# Altium schematic sheet Power.SchDoc
size A; SheetNumber: 2; SheetTotal: 7
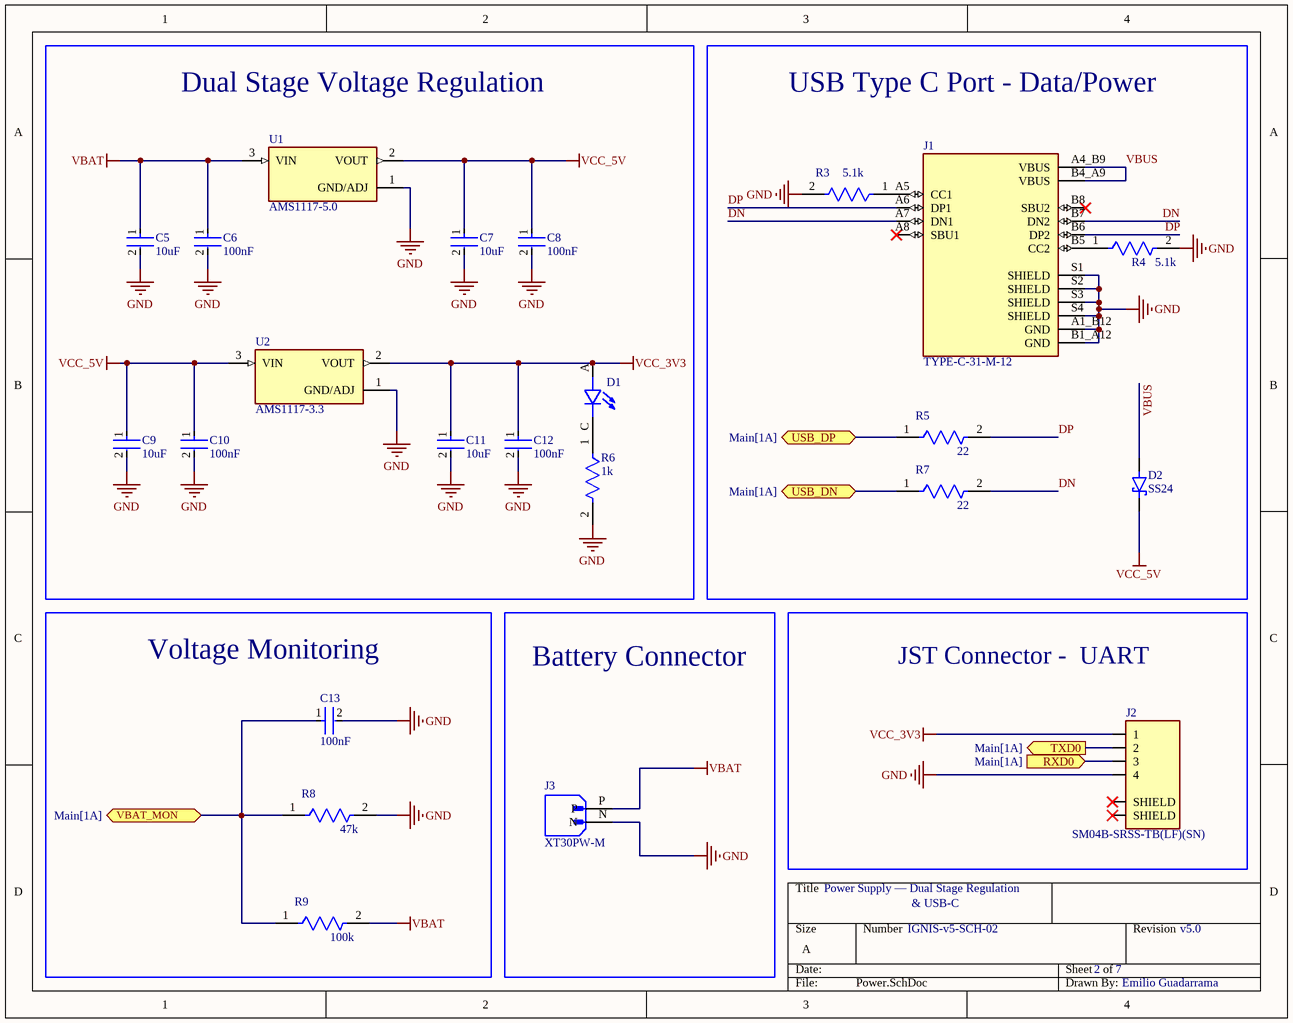
[diagram p0: Power.SchDoc]

## Parts
C5  10uF  [FP-C0805C-DN-MFG]
C6  100nF  [FP-C0805C-DN-MFG]
C7  10uF  [FP-C0805C-DN-MFG]
C8  100nF  [FP-C0805C-DN-MFG]
C9  10uF  [FP-C0805C-DN-MFG]
C10  100nF  [FP-C0805C-DN-MFG]
C11  10uF  [FP-C0805C-DN-MFG]
C12  100nF  [FP-C0805C-DN-MFG]
C13  100nF  [FP-C0805C-DN-MFG]
D1  SML-LXT0805IW-TR  [LEDC2012X120N]  (value not drawn)
D2  SS24  [DIOM4336X265N]
J1  TYPE-C-31-M-12  [HRO_TYPE-C-31-M-12]
J2  SM04B-SRSS-TB(LF)(SN)  [JST_SM04B-SRSS-TB(LF)(SN)]
J3  XT30PW-M  [AMASS_XT30PW-M]
R3  5.1k  [FP-MCT0603-IPC_A]
R4  5.1k  [FP-MCT0603-IPC_A]
R5  22  [FP-MCT0603-IPC_A]
R6  1k  [FP-MCT0603-IPC_A]
R7  22  [FP-MCT0603-IPC_A]
R8  47k  [FP-MCT0603-IPC_A]
R9  100k  [FP-MCT0603-IPC_A]
U1  AMS1117-5.0  [SOT229P700X180-4N]
U2  AMS1117-3.3  [SOT229P700X180-4N]

## Blocks framed on the sheet
Dual Stage Voltage Regulation: C5-C12 D1 R6 U1 U2
USB Type C Port - Data/Power: D2 J1 R3-R5 R7
Voltage Monitoring: C13 R8 R9
Battery Connector: J3
JST Connector -  UART: J2

## Ports
RXD0 (in, see Main[1A]), TXD0 (out, see Main[1A]), USB_DN (bidir, see Main[1A]), USB_DP (bidir, see Main[1A]), VBAT_MON (bidir, see Main[1A])

## Nets
GND: C5.2 C6.2 C7.2 C8.2 C9.2 C10.2 C11.2 C12.2 C13.2 J1.A1_B12(GND) J1.B1_A12(GND) J1.S1(SHIELD) J1.S2(SHIELD) J1.S3(SHIELD) J1.S4(SHIELD) J2.4 J3.N R3.2 R4.2 R6.2 R8.2 U1.1(GND/ADJ) U2.1(GND/ADJ)
VBAT: C5.1 C6.1 J3.P R9.2 U1.3(VIN)
VCC_3V3: C11.1 C12.1 D1.A J2.1 U2.2(VOUT)
VCC_5V: C7.1 C8.1 C9.1 C10.1 D2.C(K) U1.2(VOUT) U2.3(VIN)
DN: J1.A7(DN1) J1.B7(DN2) R7.2
DP: J1.A6(DP1) J1.B6(DP2) R5.2
RXD0: J2.3 ; port RXD0
TXD0: J2.2 ; port TXD0
USB_DN: R7.1 ; port USB_DN
USB_DP: R5.1 ; port USB_DP
VBAT_MON: C13.1 R8.1 R9.1 ; port VBAT_MON
VBUS: D2.A J1.A4_B9(VBUS) J1.B4_A9(VBUS)
NetD1_C: D1.C R6.1
NetJ1_A5: J1.A5(CC1) R3.1
NetJ1_B5: J1.B5(CC2) R4.1

Not connected (* = marked no-connect by the designer): J1 A8(SBU1)* B8(SBU2)*; J2 S1(SHIELD)* S2(SHIELD)*

## Notes on the sheet
- Power Supply — Dual Stage Regulation
- & USB-C
- IGNIS-v5-SCH-02
- 2
- 7
- v5.0
- Emilio Guadarrama

## Library data of the parts
C5-C13 = CMP-2007-00279-2: CAP CER 0.1UF 50V X7R 0805; Manufacturer Part Number: C0805C104K5RACTU; Manufacturer: KEMET; Tolerance: 0.1; Temperature Coefficient: 30ppm/°C; Material: Ceramic; Device Class L2: Capacitors; Temperature Range Low: -55°C; Voltage Rating: 50 V; Digikey Description: CAP CER 0.1UF 50V X7R 0805; Category: Cap; ComponentLink2Description: Datasheet; Octopart: https://octopart.com/c0805c104k5ractu-kemet-143926; RoHS: TRUE; ComponentLink2URL: https://content.kemet.com/datasheets/KEM_C1003_C0G_SMD.pdf; Temperature Characteristic: X7R; Temperature: -55°C to +125°C; Height: 0.88mm; Temperature Range High: +125°C; Device Class L1: Passive Components; Automotive: No; Lead Free: Yes; Ipc Land Pattern Name: CAPC200125X78; Device Class L3: Ceramic Capacitors; Mouser Description: Cap Ceramic 0.1uF 50V X7R 10% SMD 2.0 x 1.2 mm 125 C Paper T/R; Package: C0805C-DN
  C5 C7 C9 C11: Value: 10 uF; Capacitance: 10 uF
  C6 C8 C10 C12 C13: Value: 100 nF; Capacitance: 100 nF
D1 = SML-LXT0805IW-TR: LED;Red;11mcd;0.061In.Dia.;SMD;100mA;2V Vf;635nm;140deg;SMD;White Diffused;5V Vr | Lumex SML-LXT0805IW-TR; MF: Lumex Opto/Components; SnapEDA_Link: https://www.snapeda.com/parts/SML-LXT0805IW-TR/Lumex+Opto%252FComponents+Inc./view-part/?ref=snap; Package: 0805 Lumex; Value: *; MP: SML-LXT0805IW-TR; Check_prices: https://www.snapeda.com/parts/SML-LXT0805IW-TR/Lumex+Opto%252FComponents+Inc./view-part/?ref=eda
D2 = SS24: 2A, 40V, Schottky Rectifier; MF: Taiwan Semiconductor; Package: SMB-2 Taiwan Semiconductor; Price: None; Value: *; SnapEDA_Link: https://www.snapeda.com/parts/SS24/Taiwan+Semiconductor/view-part/?ref=snap; MP: SS24; Availability: In Stock; Check_prices: https://www.snapeda.com/parts/SS24/Taiwan+Semiconductor/view-part/?ref=eda
J1 = TYPE-C-31-M-12: USB Connectors 24 Receptacle 1 8.94*7.3mm RoHS; MF: HRO Electronics Co., Ltd.; SnapEDA_Link: https://www.snapeda.com/parts/TYPE-C-31-M-12/HRO+Electronics+Co.%252C+Ltd./view-part/?ref=snap; Package: Package; Value: *; MP: TYPE-C-31-M-12; Check_prices: https://www.snapeda.com/parts/TYPE-C-31-M-12/HRO+Electronics+Co.%252C+Ltd./view-part/?ref=eda
J2 = SM04B-SRSS-TB(LF)(SN): Connector Header Surface Mount, Right Angle 4 position 0.039 (1.00mm); MF: JST Sales; SnapEDA_Link: https://www.snapeda.com/parts/SM04B-SRSS-TB(LF)(SN)/JST/view-part/?ref=snap; Package: None; Value: *; MP: SM04B-SRSS-TB(LF)(SN); Check_prices: https://www.snapeda.com/parts/SM04B-SRSS-TB(LF)(SN)/JST/view-part/?ref=eda
J3 = XT30PW-M: Socket; DC supply; XT30; male; PIN: 2; on PCBs; THT; Colour: yellow; MF: AMASS; SnapEDA_Link: https://www.snapeda.com/parts/XT30PW-M/AMASS/view-part/?ref=snap; Package: None; Value: *; MP: XT30PW-M; Check_prices: https://www.snapeda.com/parts/XT30PW-M/AMASS/view-part/?ref=eda
R3 R4 = CMP-02407-011165-1: RES SMD 100 OHM 1% 1/8W 0603; Temperature Coefficient: 25ppm/°C; Resistance: 5.1kR; Power Rating: 125mW; Tolerance: 0.1%; Voltage Rating: 75V; Length: 1.55mm; Case Code (Imperial): 0603; Case/Package: 0603; Construction: Rectangular; Package Quantity: 1000; Number of Terminations: 2; Termination: SMD/SMT; Resistor Type: Thin Film; Features: Automotive AEC-Q200; Series: MCT 0603 - Precision; Max Operating Temperature: 155°C; Depth: 0.85mm; Max Power Dissipation: 125mW; Min Operating Temperature: -55°C; Width: 0.033inch; Case Code (Metric): 1608; Packaging: Tape and Reel; Weight: 6.7E-05oz; Military Standard: Not; Height: 0.022inch
R5 R7 = CMP-02407-011165-1: RES SMD 100 OHM 1% 1/8W 0603; Temperature Coefficient: 25ppm/°C; Resistance: 22R; Power Rating: 125mW; Tolerance: 0.1%; Voltage Rating: 75V; Length: 1.55mm; Case Code (Imperial): 0603; Case/Package: 0603; Construction: Rectangular; Package Quantity: 1000; Number of Terminations: 2; Termination: SMD/SMT; Resistor Type: Thin Film; Features: Automotive AEC-Q200; Series: MCT 0603 - Precision; Max Operating Temperature: 155°C; Depth: 0.85mm; Max Power Dissipation: 125mW; Min Operating Temperature: -55°C; Width: 0.033inch; Case Code (Metric): 1608; Packaging: Tape and Reel; Weight: 6.7E-05oz; Military Standard: Not; Height: 0.022inch
R6 = CMP-02407-011165-1: RES SMD 100 OHM 1% 1/8W 0603; Temperature Coefficient: 25ppm/°C; Resistance: 1kR; Power Rating: 125mW; Tolerance: 0.1%; Voltage Rating: 75V; Length: 1.55mm; Case Code (Imperial): 0603; Case/Package: 0603; Construction: Rectangular; Package Quantity: 1000; Number of Terminations: 2; Termination: SMD/SMT; Resistor Type: Thin Film; Features: Automotive AEC-Q200; Series: MCT 0603 - Precision; Max Operating Temperature: 155°C; Depth: 0.85mm; Max Power Dissipation: 125mW; Min Operating Temperature: -55°C; Width: 0.033inch; Case Code (Metric): 1608; Packaging: Tape and Reel; Weight: 6.7E-05oz; Military Standard: Not; Height: 0.022inch
R8 = CMP-02407-011165-1: RES SMD 100 OHM 1% 1/8W 0603; Temperature Coefficient: 25ppm/°C; Resistance: 47kR; Power Rating: 125mW; Tolerance: 0.1%; Voltage Rating: 75V; Length: 1.55mm; Case Code (Imperial): 0603; Case/Package: 0603; Construction: Rectangular; Package Quantity: 1000; Number of Terminations: 2; Termination: SMD/SMT; Resistor Type: Thin Film; Features: Automotive AEC-Q200; Series: MCT 0603 - Precision; Max Operating Temperature: 155°C; Depth: 0.85mm; Max Power Dissipation: 125mW; Min Operating Temperature: -55°C; Width: 0.033inch; Case Code (Metric): 1608; Packaging: Tape and Reel; Weight: 6.7E-05oz; Military Standard: Not; Height: 0.022inch
R9 = CMP-02407-011165-1: RES SMD 100 OHM 1% 1/8W 0603; Temperature Coefficient: 25ppm/°C; Resistance: 100kR; Power Rating: 125mW; Tolerance: 0.1%; Voltage Rating: 75V; Length: 1.55mm; Case Code (Imperial): 0603; Case/Package: 0603; Construction: Rectangular; Package Quantity: 1000; Number of Terminations: 2; Termination: SMD/SMT; Resistor Type: Thin Film; Features: Automotive AEC-Q200; Series: MCT 0603 - Precision; Max Operating Temperature: 155°C; Depth: 0.85mm; Max Power Dissipation: 125mW; Min Operating Temperature: -55°C; Width: 0.033inch; Case Code (Metric): 1608; Packaging: Tape and Reel; Weight: 6.7E-05oz; Military Standard: Not; Height: 0.022inch
U1 U2 = AMS1117-5.0: 1A LOW DROPOUT VOLTAGE REGULATOR; MF: ams; MP: AMS1117-5.0; Package: SOT-223 Seeed Technology; SnapEDA_Link: https://www.snapeda.com/parts/AMS1117-5.0/ams/view-part/?ref=snap; Check_prices: https://www.snapeda.com/parts/AMS1117-5.0/ams/view-part/?ref=eda; Availability: Not in stock; Value: *; Price: None